# Altium schematic sheet CAN.SchDoc
size A3
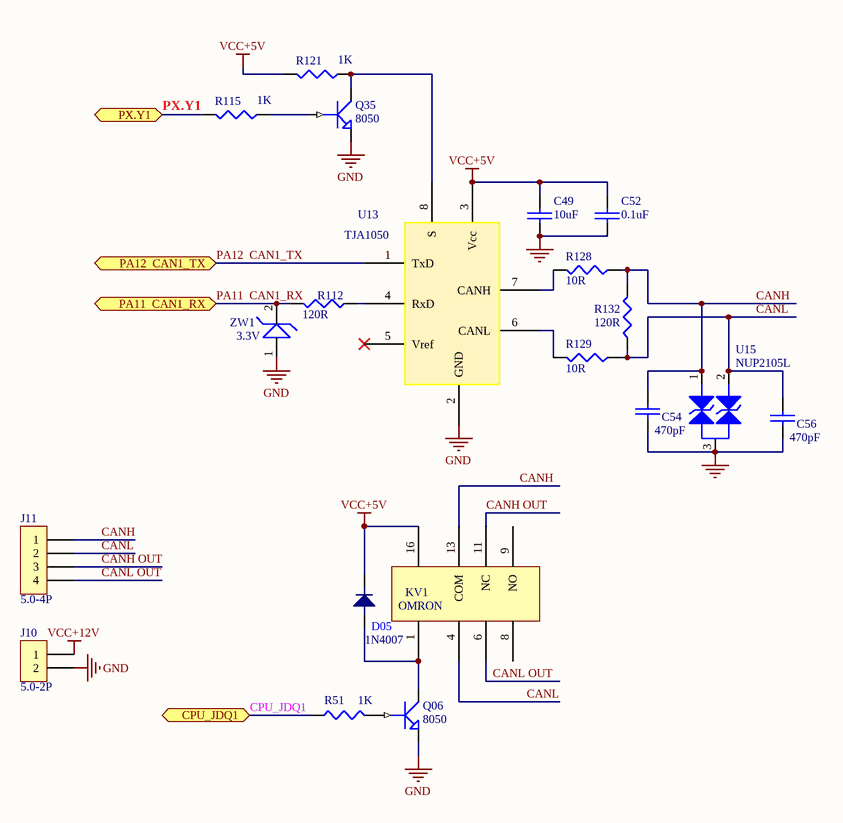
[diagram p0: CAN.SchDoc]

## Parts
C49  10uF  [0805]
C52  0.1uF  [0603]
C54  470pF  [0603]
C56  470pF  [0603]
D05  1N4007  [DO-214AC(SMA)]
J10  5.0-2P  [5.0-2]
J11  5.0-4P  [5.0-4]
KV1  OMRON  [KV]
Q06  8050  [SOT-23]
Q35  8050  [SOT-23]
R51  1K  [0603]
R112  120R  [0603]
R115  1K  [0603]
R121  1K  [0603]
R128  10R  [0603]
R129  10R  [0603]
R132  120R  [0603]
U13  TJA1050  [SO-8]
U15  NUP2105L  [SOT-23]
ZW1  3.3V  [LL-34]

## Ports
CPU_JDQ1, PA11  CAN1_RX, PA12  CAN1_TX, PX.Y1

## Nets
GND: C49.2 C52.1 C54.1 C56.1 J10.2 Q06.2(E) Q35.2(E) U13.2(GND) U15.3 ZW1.1
VCC+5V: C49.1 C52.2 D05.2 KV1.16 R121.2 U13.3(Vcc)
VCC+12V: J10.1
CANH: C54.2 J11.1 KV1.13(COM) R128.1 R132.2 U15.1
CANH OUT: J11.3 KV1.11(NC)
CANL: C56.2 J11.2 KV1.4 R129.1 R132.1 U15.2(K)
CANL OUT: J11.4 KV1.6
CPU_JDQ1: R51.1 ; port CPU_JDQ1
PA11  CAN1_RX: R112.2 ZW1.2 ; port PA11  CAN1_RX
PA12  CAN1_TX: U13.1(TxD) ; port PA12  CAN1_TX
PX.Y1: R115.2 ; port PX.Y1
NetD05_1: D05.1 KV1.1 Q06.3(C)
NetQ06_1: Q06.1(B) R51.2
NetQ35_1: Q35.1(B) R115.1
NetQ35_3: Q35.3(C) R121.1 U13.8(S)
NetR112_1: R112.1 U13.4(RxD)
NetR128_2: R128.2 U13.7(CANH)
NetR129_2: R129.2 U13.6(CANL)

Not connected (* = marked no-connect by the designer): KV1 8(3) 9(NO); U13 5(Vref)*

## Library data of the parts
C49 = CAP-0805: 0805陶瓷贴片电容
C52 C54 C56 = CAP-0603: 0603陶瓷贴片电容
D05 = 1N4007: 1A整流二极管
J10 = 5.0-2P: WJ301V-5.00-2P
J11 = 5.0-4P: WJ301V-5.00-4P
KV1 = OMRON: omron G5V-2 12VDC
Q06 = NPN1
Q35 = 8050: 8050 NPN型三极管
R51 = RES1
R112 R115 R121 R128 R129 R132 = RES-0603: 陶瓷贴片电阻0603封装
U13 = TJA1050: TJA1050   CAN芯片
U15 = NUP2105L: NUP2105L  TVS三极管
ZW1 = 3.3V: ZMM3V3